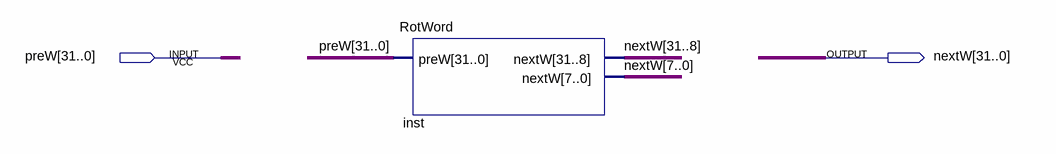
[diagram p0: schematic sheet]
// Quartus schematic RealRotWord.bdf as structural Verilog: 1 symbols, 2 pins
module RealRotWord (
  input  [31:0] preW,
  output [31:0] nextW
);

  RotWord inst (.preW(preW), .nextW(nextW));
endmodule
